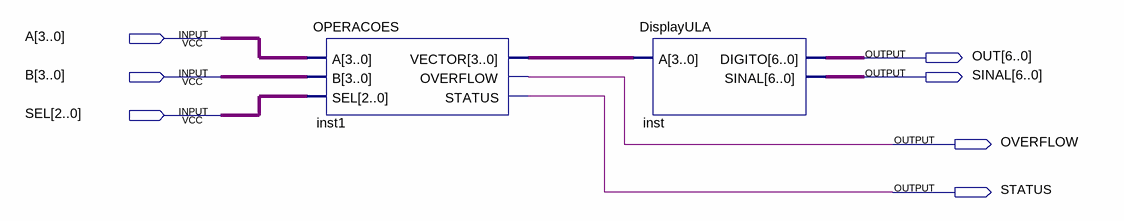
[diagram p0: schematic sheet]
// Quartus schematic ULA.bdf as structural Verilog: 2 symbols, 7 pins
module ULA (
  input  [3:0] A,
  input  [3:0] B,
  input  [2:0] SEL,
  output [6:0] OUT,
  output [6:0] SINAL,
  output OVERFLOW,
  output STATUS
);

  wire [3:0] inst1_vector;

  OPERACOES inst1 (.A(A), .B(B), .SEL(SEL), .VECTOR(inst1_vector), .OVERFLOW(OVERFLOW), .STATUS(STATUS));
  DisplayULA inst (.A(inst1_vector), .DIGITO(OUT), .SINAL(SINAL));
endmodule
